# EAGLE design backplane_v1.0 (EAGLE 6.6.0)
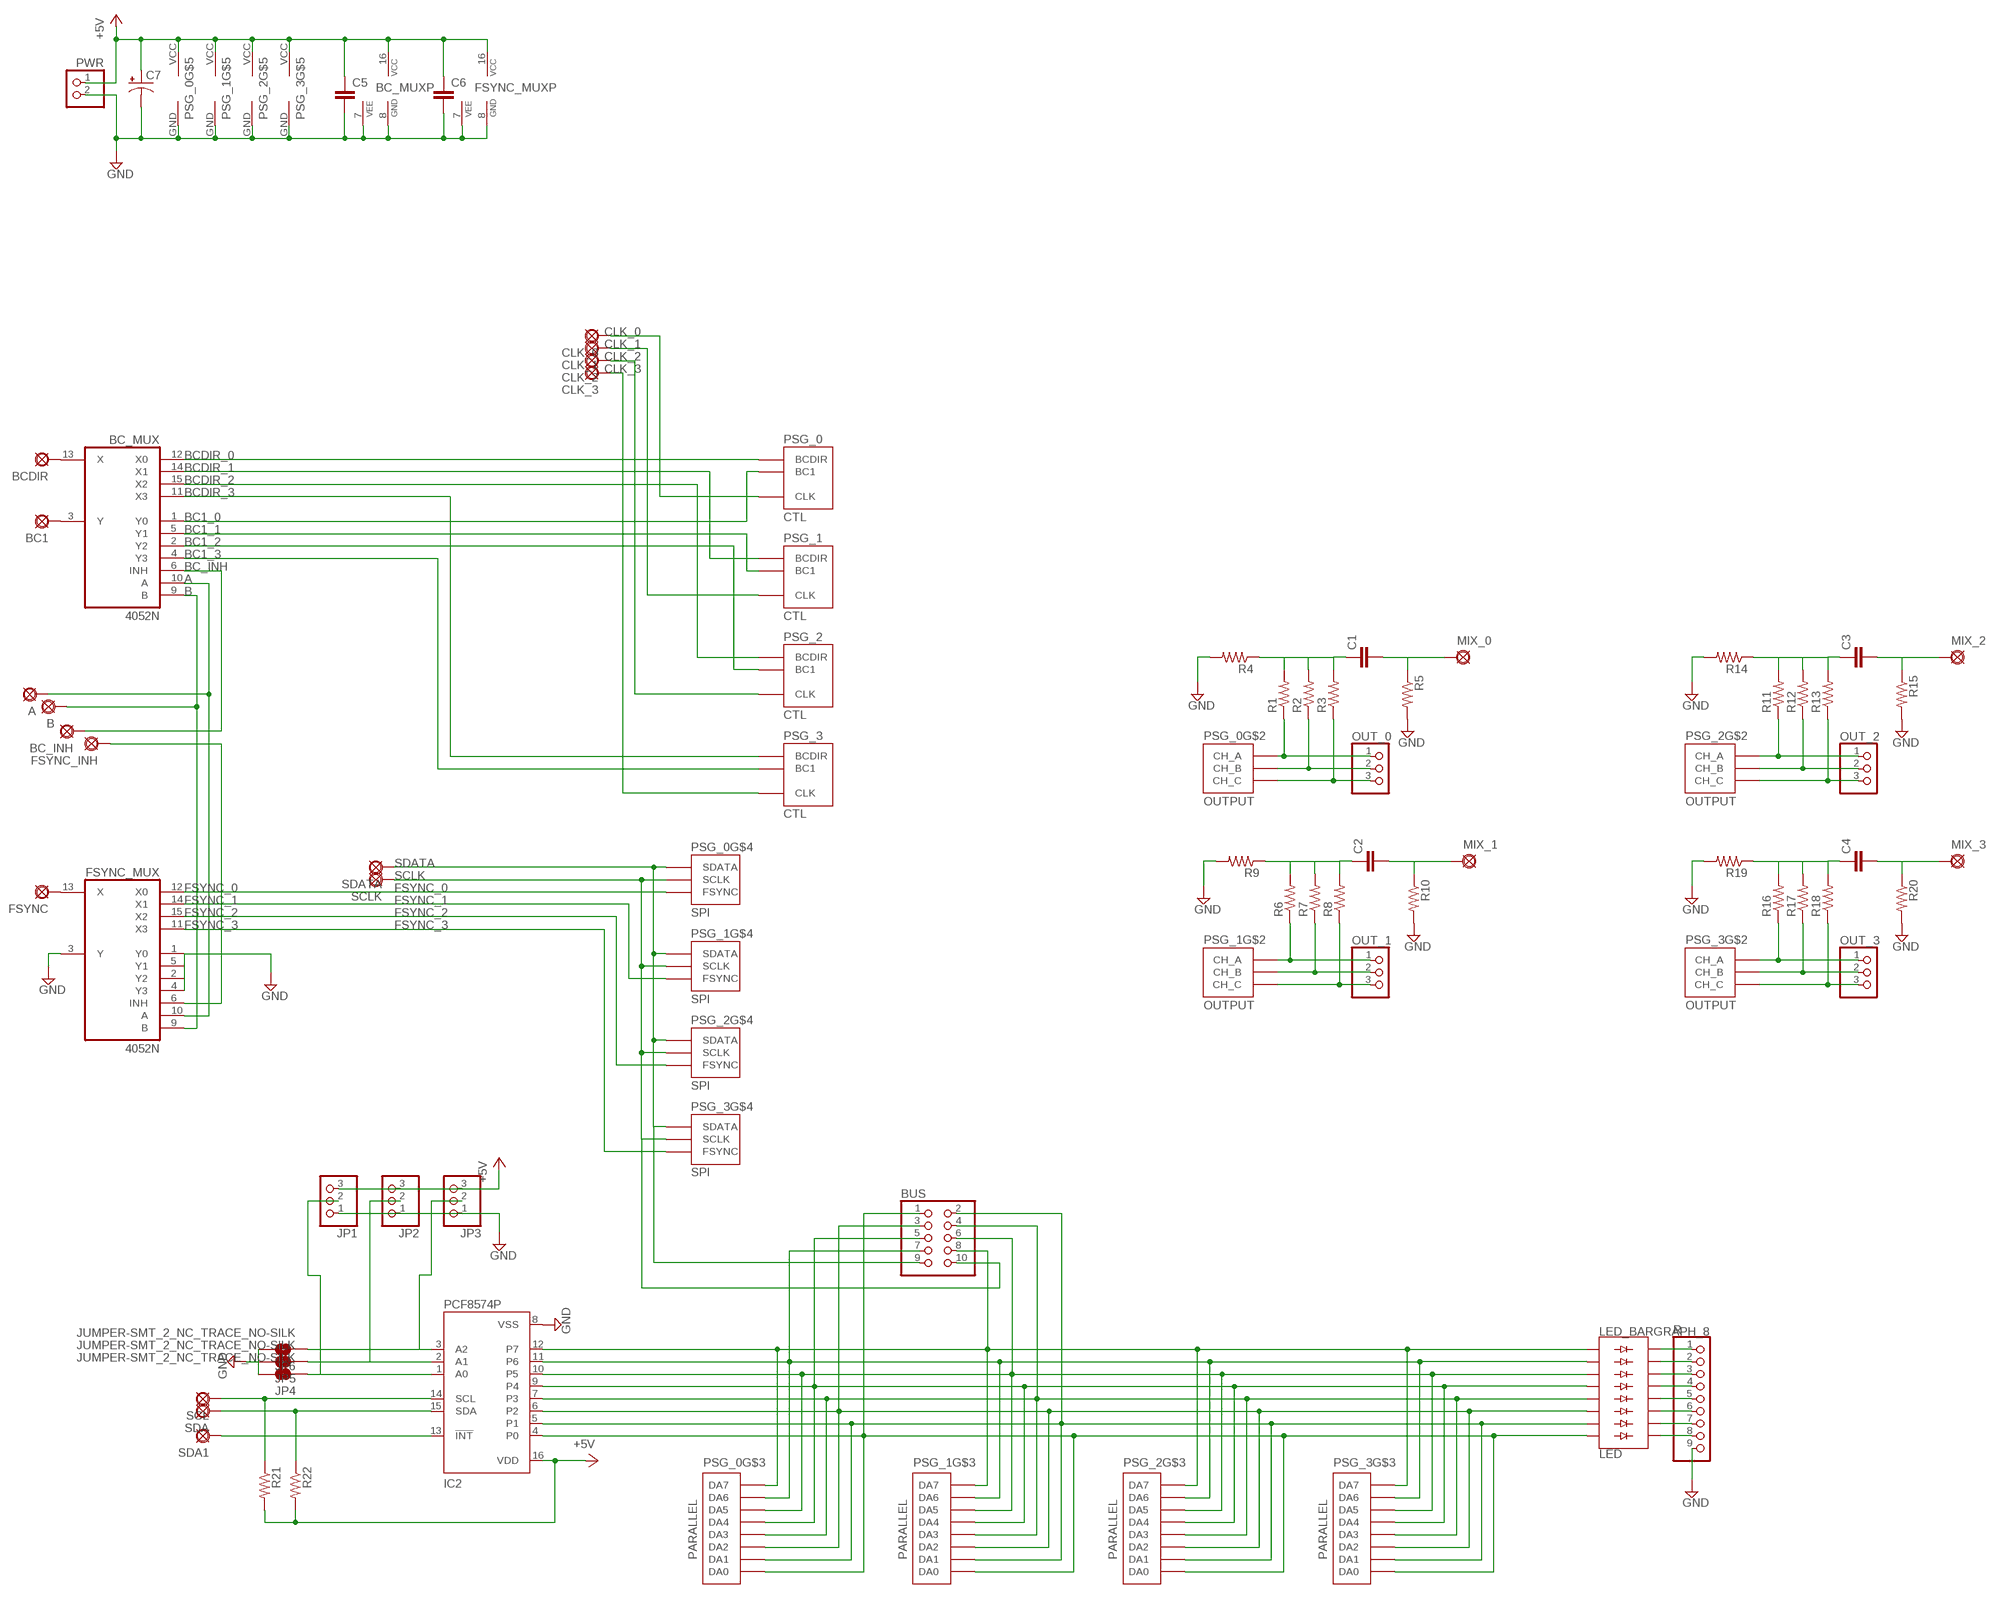
[diagram p0: schematic, sheet 1]

## Parts
A  PAD  [SQUARE]
B  PAD  [SQUARE]
BC1  PAD  [SQUARE]
BC_INH  PAD  [SQUARE]
BC_MUX  4052N  [DIL16]
BCDIR  PAD  [SQUARE]
BUS  PINHD-2X5IDC  [10PIN_IDC]
C1  080X0452  [080X045]
C2  080X0452  [080X045]
C3  080X0452  [080X045]
C4  080X0452  [080X045]
C5  050X030_0251  [050X030_025]
C6  050X030_0251  [050X030_025]
C7  0631  [063_025]
CLK_0  PAD  [SQUARE]
CLK_1  PAD  [SQUARE]
CLK_2  PAD  [SQUARE]
CLK_3  PAD  [SQUARE]
FSYNC  PAD  [SQUARE]
FSYNC_INH  PAD  [SQUARE]
FSYNC_MUX  4052N  [DIL16]
IC2  PCF8574P  [DIL16]
JP1  PINHD-1X3  [1X03]
JP2  PINHD-1X3  [1X03]
JP3  PINHD-1X3  [1X03]
JP4  JUMPER-SMT_2_NC_TRACE_NO-SILK  [SMT-JUMPER_2_NC_TRACE_NO-SILK]
JP5  JUMPER-SMT_2_NC_TRACE_NO-SILK  [SMT-JUMPER_2_NC_TRACE_NO-SILK]
JP6  JUMPER-SMT_2_NC_TRACE_NO-SILK  [SMT-JUMPER_2_NC_TRACE_NO-SILK]
LED  LED_BARGRAPH_8  [LED_BARGRAPH_8]
MIX_0  PAD  [SQUARE]
MIX_1  PAD  [SQUARE]
MIX_2  PAD  [SQUARE]
MIX_3  PAD  [SQUARE]
OUT_0  PINHD-1X3  [1X03]
OUT_1  PINHD-1X3  [1X03]
OUT_2  PINHD-1X3  [1X03]
OUT_3  PINHD-1X3  [1X03]
PSG_0  PSG_DAUGHTER  [PSG_DAUGHTER]
PSG_1  PSG_DAUGHTER  [PSG_DAUGHTER]
PSG_2  PSG_DAUGHTER  [PSG_DAUGHTER]
PSG_3  PSG_DAUGHTER  [PSG_DAUGHTER]
PWR  PINHD-1X2  [1X02]
R  PINHD-1X9  [1X09]
R1  6MM.3  [R0207/3]
R2  6MM.3  [R0207/3]
R3  6MM.3  [R0207/3]
R4  6MM.3  [R0207/3]
R5  6MM.3  [R0207/3]
R6  6MM.3  [R0207/3]
R7  6MM.3  [R0207/3]
R8  6MM.3  [R0207/3]
R9  6MM.3  [R0207/3]
R10  6MM.3  [R0207/3]
R11  6MM.3  [R0207/3]
R12  6MM.3  [R0207/3]
R13  6MM.3  [R0207/3]
R14  6MM.3  [R0207/3]
R15  6MM.3  [R0207/3]
R16  6MM.3  [R0207/3]
R17  6MM.3  [R0207/3]
R18  6MM.3  [R0207/3]
R19  6MM.3  [R0207/3]
R20  6MM.3  [R0207/3]
R21  6MM.3  [R0207/3]
R22  6MM.3  [R0207/3]
SCL  PAD  [SQUARE]
SCLK  PAD  [SQUARE]
SDA  PAD  [SQUARE]
SDA1  PAD  [SQUARE]
SDATA  PAD  [SQUARE]

## Nets
+5V: BC_MUX.16(VCC) C5.1 C6.1 C7.+ FSYNC_MUX.16(VCC) IC2.16(VDD) JP1.3 JP2.3 JP3.3 PSG_0.VCC PSG_1.VCC PSG_2.VCC PSG_3.VCC PWR.1 R21.2 R22.2
A: A.1(PAD) BC_MUX.10(A) FSYNC_MUX.10(A)
A0: IC2.1(A0) JP1.2 JP4.1
A1: IC2.2(A1) JP2.2 JP5.1
A2: IC2.3(A2) JP3.2 JP6.1
B: B.1(PAD) BC_MUX.9(B) FSYNC_MUX.9(B)
BC1_0: BC_MUX.1(Y0) PSG_0.BC1
BC1_1: BC_MUX.5(Y1) PSG_1.BC1
BC1_2: BC_MUX.2(Y2) PSG_2.BC1
BC1_3: BC_MUX.4(Y3) PSG_3.BC1
BC_INH: BC_INH.1(PAD) BC_MUX.6(INH)
BCDIR_0: BC_MUX.12(X0) PSG_0.BCDIR
BCDIR_1: BC_MUX.14(X1) PSG_1.BCDIR
BCDIR_2: BC_MUX.15(X2) PSG_2.BCDIR
BCDIR_3: BC_MUX.11(X3) PSG_3.BCDIR
CLK_0: CLK_0.1(PAD) PSG_0.CLK
CLK_1: CLK_1.1(PAD) PSG_1.CLK
CLK_2: CLK_2.1(PAD) PSG_2.CLK
CLK_3: CLK_3.1(PAD) PSG_3.CLK
FSYNC: FSYNC.1(PAD) FSYNC_MUX.13(X)
FSYNC_0: FSYNC_MUX.12(X0) PSG_0.FSYNC
FSYNC_1: FSYNC_MUX.14(X1) PSG_1.FSYNC
FSYNC_2: FSYNC_MUX.15(X2) PSG_2.FSYNC
FSYNC_3: FSYNC_MUX.11(X3) PSG_3.FSYNC
FSYNC_INH: FSYNC_INH.1(PAD) FSYNC_MUX.6(INH)
GND: BC_MUX.7(VEE) BC_MUX.8(GND) C5.2 C6.2 C7.- FSYNC_MUX.1(Y0) FSYNC_MUX.2(Y2) FSYNC_MUX.3(Y) FSYNC_MUX.4(Y3) FSYNC_MUX.5(Y1) FSYNC_MUX.7(VEE) FSYNC_MUX.8(GND) IC2.8(VSS) JP1.1 JP2.1 JP3.1 JP4.2 JP5.2 JP6.2 PSG_0.GND PSG_1.GND PSG_2.GND PSG_3.GND PWR.2 R4.2 R5.2 R9.2 R10.2 R14.2 R15.2 R19.2 R20.2 R.9
N$1: C1.1 R1.2 R2.2 R3.2 R4.1
N$2: BC_MUX.13(X) BCDIR.1(PAD)
N$3: BC1.1(PAD) BC_MUX.3(Y)
N$4: IC2.14(SCL) R21.1 SCL.1(PAD)
N$5: C1.2 MIX_0.1(PAD) R5.1
N$6: IC2.15(SDA) R22.1 SDA.1(PAD)
N$8: C2.1 R6.2 R7.2 R8.2 R9.1
N$9: C2.2 MIX_1.1(PAD) R10.1
N$12: IC2.13(!INT) SDA1.1(PAD)
N$13: C3.1 R11.2 R12.2 R13.2 R14.1
N$14: C3.2 MIX_2.1(PAD) R15.1
N$15: LED.C7 R.1
N$16: BUS.8 IC2.12(P7) LED.A7 PSG_0.DA7 PSG_1.DA7 PSG_2.DA7 PSG_3.DA7
N$17: BUS.1 IC2.4(P0) LED.A0 PSG_0.DA0 PSG_1.DA0 PSG_2.DA0 PSG_3.DA0
N$18: BUS.2 IC2.5(P1) LED.A1 PSG_0.DA1 PSG_1.DA1 PSG_2.DA1 PSG_3.DA1
N$19: BUS.3 IC2.6(P2) LED.A2 PSG_0.DA2 PSG_1.DA2 PSG_2.DA2 PSG_3.DA2
N$20: BUS.4 IC2.7(P3) LED.A3 PSG_0.DA3 PSG_1.DA3 PSG_2.DA3 PSG_3.DA3
N$21: BUS.5 IC2.9(P4) LED.A4 PSG_0.DA4 PSG_1.DA4 PSG_2.DA4 PSG_3.DA4
N$22: BUS.6 IC2.10(P5) LED.A5 PSG_0.DA5 PSG_1.DA5 PSG_2.DA5 PSG_3.DA5
N$23: BUS.7 IC2.11(P6) LED.A6 PSG_0.DA6 PSG_1.DA6 PSG_2.DA6 PSG_3.DA6
N$24: OUT_0.1 PSG_0.OUT_A(CH_A) R1.1
N$25: OUT_0.2 PSG_0.OUT_B(CH_B) R2.1
N$26: OUT_0.3 PSG_0.OUT_C(CH_C) R3.1
N$27: OUT_1.1 PSG_1.OUT_A(CH_A) R6.1
N$28: OUT_1.2 PSG_1.OUT_B(CH_B) R7.1
N$29: OUT_1.3 PSG_1.OUT_C(CH_C) R8.1
N$30: OUT_2.1 PSG_2.OUT_A(CH_A) R11.1
N$31: OUT_2.2 PSG_2.OUT_B(CH_B) R12.1
N$32: OUT_2.3 PSG_2.OUT_C(CH_C) R13.1
N$33: OUT_3.1 PSG_3.OUT_A(CH_A) R16.1
N$34: OUT_3.2 PSG_3.OUT_B(CH_B) R17.1
N$35: OUT_3.3 PSG_3.OUT_C(CH_C) R18.1
N$36: LED.C6 R.2
N$37: LED.C5 R.3
N$38: C4.1 R16.2 R17.2 R18.2 R19.1
N$39: C4.2 MIX_3.1(PAD) R20.1
N$40: LED.C4 R.4
N$41: LED.C3 R.5
N$42: LED.C2 R.6
N$43: LED.C1 R.7
N$44: LED.C0 R.8
SCLK: BUS.10 PSG_0.SCLK PSG_1.SCLK PSG_2.SCLK PSG_3.SCLK SCLK.1(PAD)
SDATA: BUS.9 PSG_0.SDATA PSG_1.SDATA PSG_2.SDATA PSG_3.SDATA SDATA.1(PAD)

## Library data of the parts
A B BC1 BC_INH BCDIR CLK_0 CLK_1-CLK_3 FSYNC FSYNC_INH MIX_0 MIX_1-MIX_3 SCL SCLK SDA SDA1 SDATA = gm-supply:PAD: PAD use this package for pads with any purpose, including input, output, send or return various pad shapes: round, square, octogonal, long, and long offset
BC_MUX FSYNC_MUX = 40xx:4052: Dual 4-channel ANALOG MULTIPLEXER
BUS = jaapie:PINHD-2X5: PIN HEADER
C1-C4 = gm-caps-film-chicklet:080X045: 0.056 - 0.082uF Panasonic ECQ-B 8mm x 4.5mm 50V: 0.056 - 0.082uF;
C5 C6 = gm-caps-ceramic:050X030_025: 47 - 120pF Xicon Ceramic Disc 2.5mm lead spacing
C7 = gm-caps-electro-pol:063: 33 - 220uF Xicon values at Mouser.com 10V: 220uF; 16V: 100uF; 25V: 100uF; 50V: 33uF
IC2 = micro-philips:PCF8574: I2C-Bus Remote 8-bit I/O expander http://www.semiconductors.philips.com/acrobat_download/datasheets/PCF8574_4.pdf; MPN: PCF8574PN; OC_FARNELL: 204020; OC_NEWARK: 11N8515
JP1-JP3 OUT_0 OUT_1-OUT_3 = pinhead:PINHD-1X3: PIN HEADER
JP4-JP6 = SparkFun-Jumpers:JUMPER-SMT_2_NC_TRACE: Normally closed trace jumper This jumper has a trace between two pads so it's normally closed (NC). Use a razor knife to open the connection. For best results follow the IPC guidelines for cutting traces: Cutout at least 0.063 mm (0.005 in). Remove all loose material to clean up the cut area. Seal the cut with an approved epoxy. Reapply solder to reclose the connection.
LED = jaapie:LED_BARGRAPH_8
PSG_0 PSG_1-PSG_3 = jaapie:PSG_DAUGHTER
PWR = pinhead:PINHD-1X2: PIN HEADER
R = pinhead:PINHD-1X9: PIN HEADER
R1-R22 = gm-resistors:6MM: 6mm Resistors Leads spaced 1-6 holes apart for 0.1" perfboard. Suitable for 1/4 watt resistors.

## Board
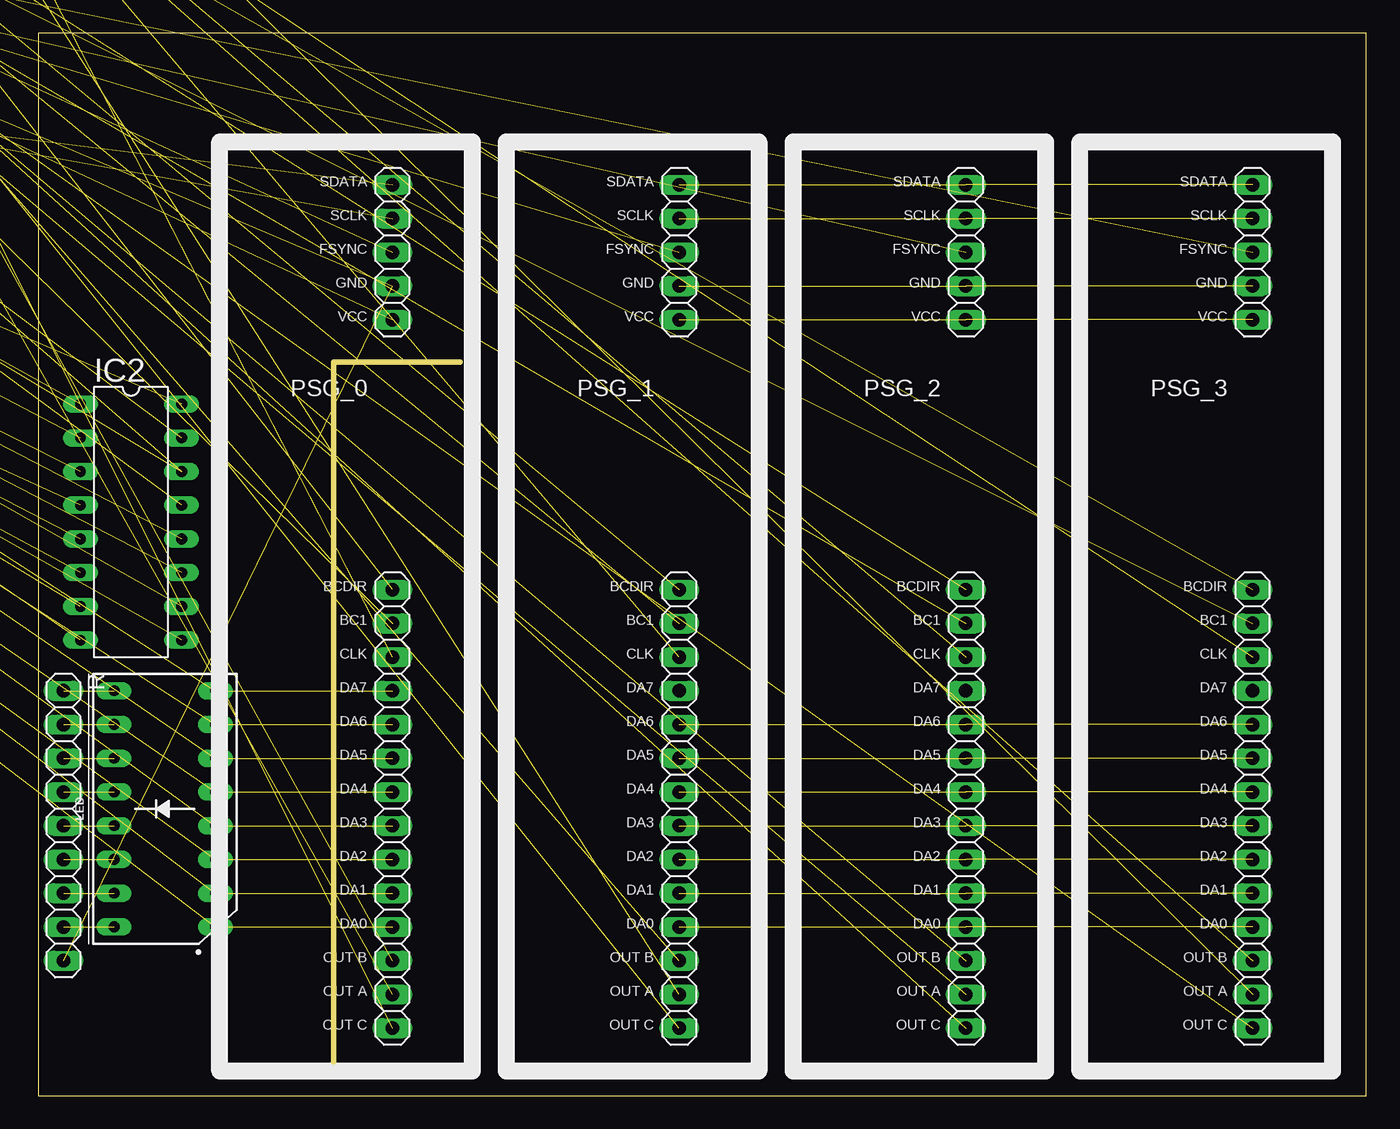
[diagram p1: board, top side]
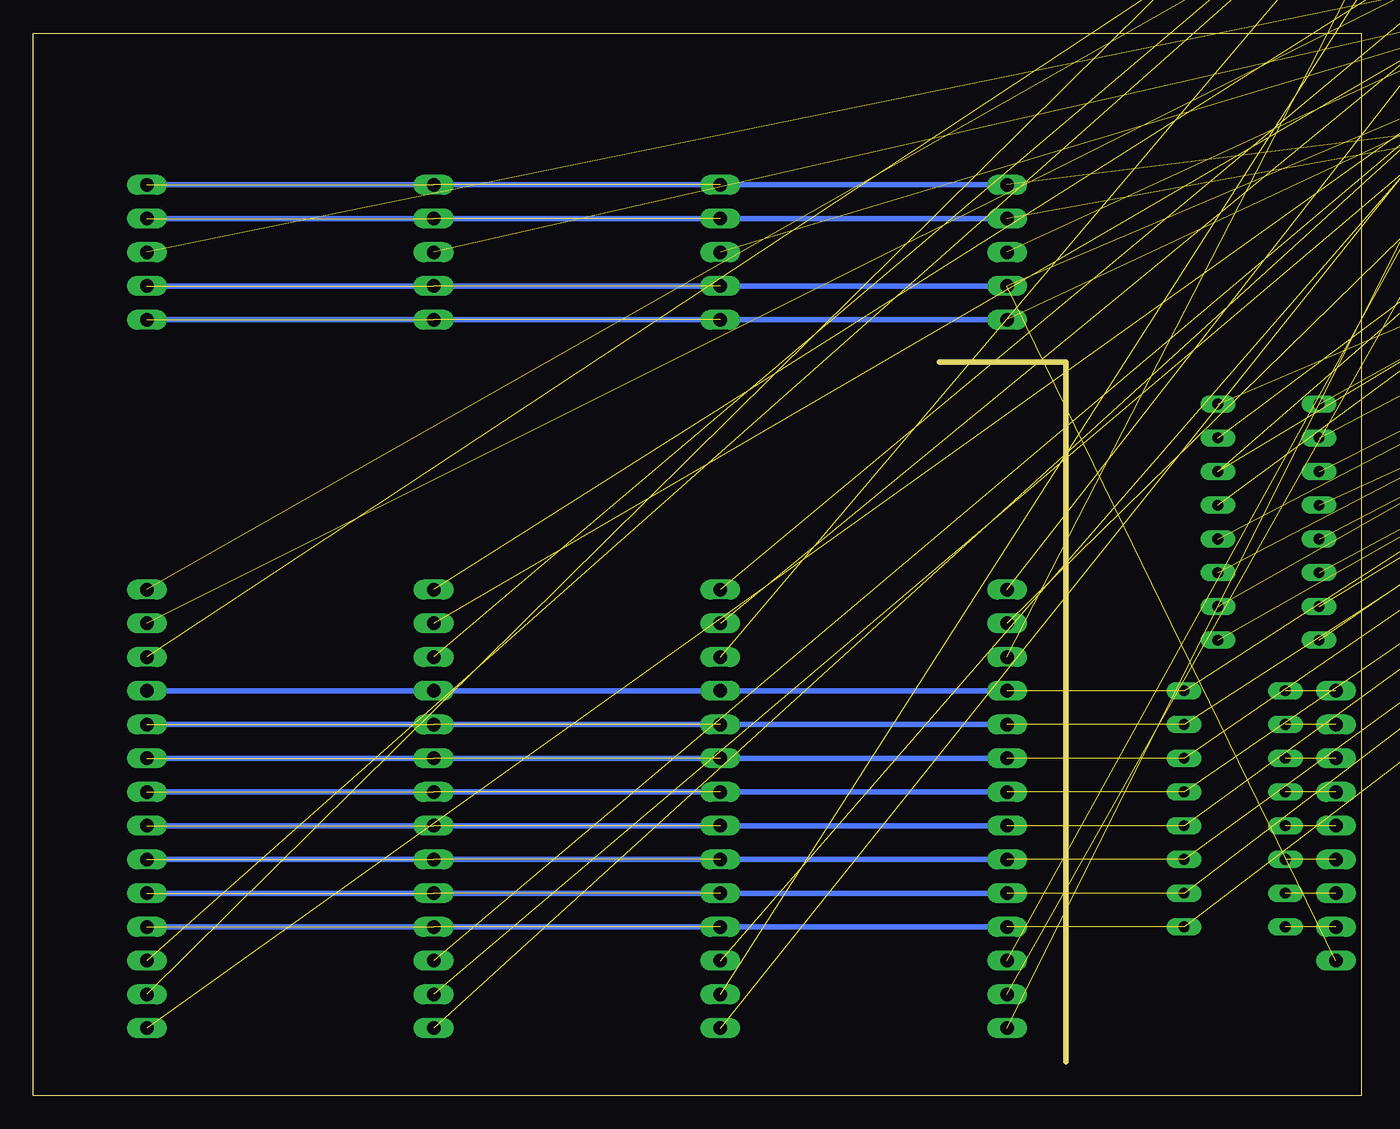
[diagram p2: board, bottom side, seen from below]

Size 100 x 80 mm. Coordinates in mm from the lower left corner, seen from the top.
Outline: 22.23,2.54 22.23,55.24 31.75,55.24
Outline: 0,0 100,0 100,80 0,80 0,0
Copper layers (1*16): Top 0.035mm / dielectric 1.5mm / Bottom 0.035mm
Design rules "default": minimum track width 10mil, minimum drill 24mil, track to track 8mil, track to pad 8mil, pad to pad 8mil, via to via 8mil, smd to smd 8mil, copper to edge 40mil, drill to drill 8mil, minimum pad ring 10mil, minimum via ring 8mil, stop-mask expansion 4mil, vias tented up to drill 0mil, thermal gap 10mil

### Footprints (pad centres in the part's own frame; a part is rotated, then mirrored left to right if it is on the bottom)
SQUARE = drill 0.7 square: 1 0,0
DIL16 = drill 0.813 long: 1 -8.89,-3.81; 2 -6.35,-3.81; 3 -3.81,-3.81; 4 -1.27,-3.81; 5 1.27,-3.81; 6 3.81,-3.81; 7 6.35,-3.81; 8 8.89,-3.81; 9 8.89,3.81; 10 6.35,3.81; 11 3.81,3.81; 12 1.27,3.81; 13 -1.27,3.81; 14 -3.81,3.81; 15 -6.35,3.81; 16 -8.89,3.81
10PIN_IDC = drill 1.016 octagon: 1 -5.08,-1.27; 2 -5.08,1.27; 3 -2.54,-1.27; 4 -2.54,1.27; 5 0,-1.27; 6 0,1.27; 7 2.54,-1.27; 8 2.54,1.27; 9 5.08,-1.27; 10 5.08,1.27
080X045 = drill 0.7: 1 -2.54,0; 2 2.54,0
050X030_025 = drill 0.7: 1 -1.27,0; 2 1.27,0
063_025 = drill 0.7 square: + -1.27,0 | drill 0.7: - 1.27,0
1X03 = drill 1.016 long: 1 -2.54,0; 2 0,0; 3 2.54,0
SMT-JUMPER_2_NC_TRACE_NO-SILK = smd 0.635 x 1.27: 1 -0.508,0; 2 0.508,0
LED_BARGRAPH_8 = drill 0.813 long: A0 -8.89,-3.81; A1 -6.35,-3.81; A2 -3.81,-3.81; A3 -1.27,-3.81; A4 1.27,-3.81; A5 3.81,-3.81; A6 6.35,-3.81; A7 8.89,-3.81; C0 -8.89,3.81; C1 -6.35,3.81; C2 -3.81,3.81; C3 -1.27,3.81; C4 1.27,3.81; C5 3.81,3.81; C6 6.35,3.81; C7 8.89,3.81
PSG_DAUGHTER = drill 1.016 long: BC1 0,-1.27; BCDIR 0,1.27; CLK 0,-3.81; DA0 0,-24.13; DA1 0,-21.59; DA2 0,-19.05; DA3 0,-16.51; DA4 0,-13.97; DA5 0,-11.43; DA6 0,-8.89; DA7 0,-6.35; FSYNC 0,26.67; GND 0,24.13; OUT_A 0,-29.21; OUT_B 0,-26.67; OUT_C 0,-31.75; SCLK 0,29.21; SDATA 0,31.75; VCC 0,21.59
1X02 = drill 1.016 long: 1 -1.27,0; 2 1.27,0
1X09 = drill 1.016 long: 1 -10.16,0; 2 -7.62,0; 3 -5.08,0; 4 -2.54,0; 5 0,0; 6 2.54,0; 7 5.08,0; 8 7.62,0; 9 10.16,0
R0207/3 = drill 0.7: 1 -3.81,0; 2 3.81,0

### Placement (x,y rotation side)
A  -16.51,127 0 top  (outside the outline)
B  -21.59,127 0 top  (outside the outline)
BC1  -111.76,124.46 0 top  (outside the outline)
BC_INH  -86.36,121.92 0 top  (outside the outline)
BC_MUX  -24.13,97.79 0 top  (outside the outline)
BCDIR  -113.03,121.92 0 top  (outside the outline)
BUS  -69.85,81.28 0 top  (outside the outline)
C1  -81.28,106.68 0 top  (outside the outline)
C2  -90.17,106.68 0 top  (outside the outline)
C3  -99.06,106.68 0 top  (outside the outline)
C4  -107.95,106.68 0 top  (outside the outline)
C5  -67.31,105.41 0 top  (outside the outline)
C6  -73.66,105.41 0 top  (outside the outline)
C7  -40.64,95.25 0 top  (outside the outline)
CLK_0  -20.32,124.46 0 top  (outside the outline)
CLK_1  -29.21,124.46 0 top  (outside the outline)
CLK_2  -38.1,124.46 0 top  (outside the outline)
CLK_3  -46.99,124.46 0 top  (outside the outline)
FSYNC  -95.25,121.92 0 top  (outside the outline)
FSYNC_INH  -76.2,121.92 0 top  (outside the outline)
FSYNC_MUX  -24.13,82.55 0 top  (outside the outline)
IC2  6.99,43.18 270 top
JP1  -72.39,93.98 0 top  (outside the outline)
JP2  -81.28,93.98 0 top  (outside the outline)
JP3  -90.17,93.98 0 top  (outside the outline)
JP4  -21.59,113.03 0 top  (outside the outline)
JP5  -38.1,113.03 0 top  (outside the outline)
JP6  -54.61,113.03 0 top  (outside the outline)
LED  9.53,21.59 90 top
MIX_0  -55.88,124.46 0 top  (outside the outline)
MIX_1  -64.77,124.46 0 top  (outside the outline)
MIX_2  -73.66,124.46 0 top  (outside the outline)
MIX_3  -82.55,124.46 0 top  (outside the outline)
OUT_0  -26.67,106.68 0 top  (outside the outline)
OUT_1  -35.56,106.68 0 top  (outside the outline)
OUT_2  -44.45,106.68 0 top  (outside the outline)
OUT_3  -53.34,106.68 0 top  (outside the outline)
PSG_0  26.67,36.83 0 top
PSG_1  48.26,36.83 0 top
PSG_2  69.85,36.83 0 top
PSG_3  91.44,36.83 0 top
PWR  -60.96,106.68 0 top  (outside the outline)
R  1.91,20.32 270 top
R1  -68.58,111.76 0 top  (outside the outline)
R2  -78.74,111.76 0 top  (outside the outline)
R3  -88.9,111.76 0 top  (outside the outline)
R4  -99.06,111.76 0 top  (outside the outline)
R5  -109.22,111.76 0 top  (outside the outline)
R6  -17.78,116.84 0 top  (outside the outline)
R7  -27.94,116.84 0 top  (outside the outline)
R8  -38.1,116.84 0 top  (outside the outline)
R9  -48.26,116.84 0 top  (outside the outline)
R10  -58.42,116.84 0 top  (outside the outline)
R11  -68.58,116.84 0 top  (outside the outline)
R12  -78.74,116.84 0 top  (outside the outline)
R13  -88.9,116.84 0 top  (outside the outline)
R14  -99.06,116.84 0 top  (outside the outline)
R15  -109.22,116.84 0 top  (outside the outline)
R16  -17.78,119.38 0 top  (outside the outline)
R17  -27.94,119.38 0 top  (outside the outline)
R18  -38.1,119.38 0 top  (outside the outline)
R19  -48.26,119.38 0 top  (outside the outline)
R20  -58.42,119.38 0 top  (outside the outline)
R21  -68.58,119.38 0 top  (outside the outline)
R22  -78.74,119.38 0 top  (outside the outline)
SCL  -118.11,124.46 0 top  (outside the outline)
SCLK  -90.17,124.46 0 top  (outside the outline)
SDA  -105.41,124.46 0 top  (outside the outline)
SDA1  -97.79,124.46 0 top  (outside the outline)
SDATA  -104.14,121.92 0 top  (outside the outline)

### Tracks (layer width: path | path; a pad name or v marks a point on that pad's centre or on a via)
+5V  (14 unrouted)
  Bottom 0.406: PSG_3.VCC PSG_0.VCC
A  (2 unrouted)
A0  (2 unrouted)
A1  (2 unrouted)
A2  (2 unrouted)
B  (2 unrouted)
BC1_0  (1 unrouted)
BC1_1  (1 unrouted)
BC1_2  (1 unrouted)
BC1_3  (1 unrouted)
BC_INH  (1 unrouted)
BCDIR_0  (1 unrouted)
BCDIR_1  (1 unrouted)
BCDIR_2  (1 unrouted)
BCDIR_3  (1 unrouted)
CLK_0  (1 unrouted)
CLK_1  (1 unrouted)
CLK_2  (1 unrouted)
CLK_3  (1 unrouted)
FSYNC  (1 unrouted)
FSYNC_0  (1 unrouted)
FSYNC_1  (1 unrouted)
FSYNC_2  (1 unrouted)
FSYNC_3  (1 unrouted)
FSYNC_INH  (1 unrouted)
GND  (31 unrouted)
  Bottom 0.406: PSG_0.GND PSG_3.GND
N$1  (4 unrouted)
N$2  (1 unrouted)
N$3  (1 unrouted)
N$4  (2 unrouted)
N$5  (2 unrouted)
N$6  (2 unrouted)
N$8  (4 unrouted)
N$9  (2 unrouted)
N$12  (1 unrouted)
N$13  (4 unrouted)
N$14  (2 unrouted)
N$15  (1 unrouted)
N$16  (3 unrouted)
  Bottom 0.406: PSG_0.DA7 PSG_1.DA7 PSG_2.DA7 PSG_3.DA7
N$17  (5 unrouted)
  Bottom 0.406: PSG_0.DA0 PSG_3.DA0
N$18  (5 unrouted)
  Bottom 0.406: PSG_3.DA1 PSG_0.DA1
N$19  (5 unrouted)
  Bottom 0.406: PSG_0.DA2 PSG_3.DA2
N$20  (5 unrouted)
  Bottom 0.406: PSG_3.DA3 PSG_0.DA3
N$21  (5 unrouted)
  Bottom 0.406: PSG_0.DA4 PSG_3.DA4
N$22  (5 unrouted)
  Bottom 0.406: PSG_3.DA5 PSG_0.DA5
N$23  (5 unrouted)
  Bottom 0.406: PSG_0.DA6 PSG_3.DA6
N$24  (2 unrouted)
N$25  (2 unrouted)
N$26  (2 unrouted)
N$27  (2 unrouted)
N$28  (2 unrouted)
N$29  (2 unrouted)
N$30  (2 unrouted)
N$31  (2 unrouted)
N$32  (2 unrouted)
N$33  (2 unrouted)
N$34  (2 unrouted)
N$35  (2 unrouted)
N$36  (1 unrouted)
N$37  (1 unrouted)
N$38  (4 unrouted)
N$39  (2 unrouted)
N$40  (1 unrouted)
N$41  (1 unrouted)
N$42  (1 unrouted)
N$43  (1 unrouted)
N$44  (1 unrouted)
SCLK  (4 unrouted)
  Bottom 0.406: PSG_3.SCLK PSG_0.SCLK
SDATA  (4 unrouted)
  Bottom 0.406: PSG_0.SDATA PSG_3.SDATA